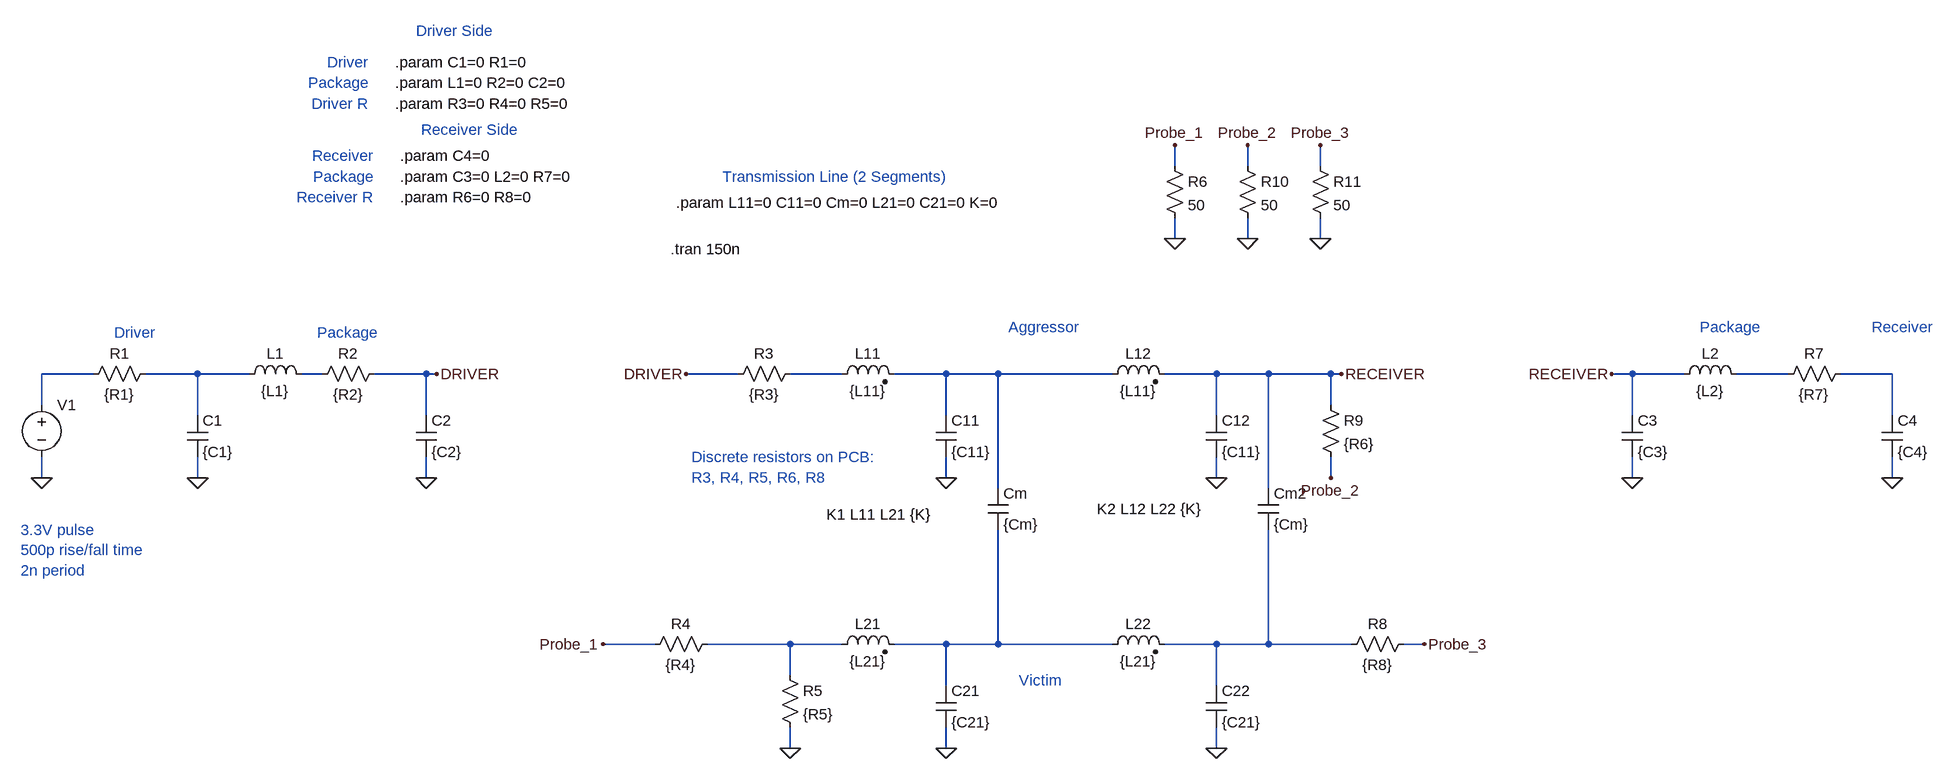
[diagram p0: schematic circuit_model.asc]
circuit_model.asc, the LTspice schematic file:
Version 4
SHEET 1 2504 696
WIRE 1328 -240 1328 -272
WIRE 1440 -240 1440 -272
WIRE 1552 -240 1552 -272
WIRE 1328 -128 1328 -160
WIRE 1440 -128 1440 -160
WIRE 1552 -128 1552 -160
WIRE -336 80 -416 80
WIRE -176 80 -256 80
WIRE -96 80 -176 80
WIRE 16 80 -16 80
WIRE 176 80 96 80
WIRE 192 80 176 80
WIRE 656 80 576 80
WIRE 816 80 736 80
WIRE 976 80 896 80
WIRE 1056 80 976 80
WIRE 1232 80 1056 80
WIRE 1392 80 1312 80
WIRE 1472 80 1392 80
WIRE 1568 80 1472 80
WIRE 1584 80 1568 80
WIRE 2032 80 2000 80
WIRE 2112 80 2032 80
WIRE 2272 80 2192 80
WIRE 2432 80 2352 80
WIRE -416 128 -416 80
WIRE 1568 128 1568 80
WIRE -176 144 -176 80
WIRE 176 144 176 80
WIRE 976 144 976 80
WIRE 1392 144 1392 80
WIRE 2032 144 2032 80
WIRE 2432 144 2432 80
WIRE -416 240 -416 208
WIRE -176 240 -176 208
WIRE 176 240 176 208
WIRE 976 240 976 208
WIRE 1392 240 1392 208
WIRE 1568 240 1568 208
WIRE 2032 240 2032 208
WIRE 2432 240 2432 208
WIRE 1056 256 1056 80
WIRE 1472 256 1472 80
WIRE 528 496 448 496
WIRE 736 496 608 496
WIRE 816 496 736 496
WIRE 976 496 896 496
WIRE 1056 496 1056 320
WIRE 1056 496 976 496
WIRE 1232 496 1056 496
WIRE 1392 496 1312 496
WIRE 1472 496 1472 320
WIRE 1472 496 1392 496
WIRE 1600 496 1472 496
WIRE 1712 496 1680 496
WIRE 736 544 736 496
WIRE 976 560 976 496
WIRE 1392 560 1392 496
WIRE 736 656 736 624
WIRE 976 656 976 624
WIRE 1392 656 1392 624
FLAG -416 240 0
FLAG -176 240 0
FLAG 176 240 0
FLAG 976 240 0
FLAG 976 656 0
FLAG 736 656 0
FLAG 1392 240 0
FLAG 1392 656 0
FLAG 2032 240 0
FLAG 2432 240 0
FLAG 192 80 DRIVER
FLAG 576 80 DRIVER
FLAG 1584 80 RECEIVER
FLAG 2000 80 RECEIVER
FLAG 448 496 Probe_1
FLAG 1712 496 Probe_3
FLAG 1568 240 Probe_2
FLAG 1552 -272 Probe_3
FLAG 1440 -272 Probe_2
FLAG 1328 -272 Probe_1
FLAG 1328 -128 0
FLAG 1440 -128 0
FLAG 1552 -128 0
SYMBOL voltage -416 112 R0
WINDOW 3 24 96 Invisible 2
WINDOW 123 0 0 Left 0
WINDOW 39 0 0 Left 0
SYMATTR Value PULSE(0 3.3 50n 500p 500p 25n 50n)
SYMATTR InstName V1
SYMBOL res -240 64 R90
WINDOW 0 0 56 VBottom 2
WINDOW 3 32 56 VTop 2
SYMATTR InstName R1
SYMATTR Value {R1}
SYMBOL cap -192 144 R0
SYMATTR InstName C1
SYMATTR Value {C1}
SYMBOL ind -112 96 R270
WINDOW 0 32 56 VTop 2
WINDOW 3 5 56 VBottom 2
SYMATTR InstName L1
SYMATTR Value {L1}
SYMBOL res 112 64 R90
WINDOW 0 0 56 VBottom 2
WINDOW 3 32 56 VTop 2
SYMATTR InstName R2
SYMATTR Value {R2}
SYMBOL cap 160 144 R0
SYMATTR InstName C2
SYMATTR Value {C2}
SYMBOL res 752 64 R90
WINDOW 0 0 56 VBottom 2
WINDOW 3 32 56 VTop 2
SYMATTR InstName R3
SYMATTR Value {R3}
SYMBOL ind2 800 96 R270
WINDOW 0 32 56 VTop 2
WINDOW 3 5 56 VBottom 2
SYMATTR InstName L11
SYMATTR Value {L11}
SYMATTR Type ind
SYMBOL cap 960 144 R0
SYMATTR InstName C11
SYMATTR Value {C11}
SYMBOL cap 1040 256 R0
SYMATTR InstName Cm
SYMATTR Value {Cm}
SYMBOL cap 960 560 R0
SYMATTR InstName C21
SYMATTR Value {C21}
SYMBOL ind2 800 512 R270
WINDOW 0 32 56 VTop 2
WINDOW 3 5 56 VBottom 2
SYMATTR InstName L21
SYMATTR Value {L21}
SYMATTR Type ind
SYMBOL res 720 528 R0
SYMATTR InstName R5
SYMATTR Value {R5}
SYMBOL res 624 480 R90
WINDOW 0 0 56 VBottom 2
WINDOW 3 32 56 VTop 2
SYMATTR InstName R4
SYMATTR Value {R4}
SYMBOL ind2 1216 96 R270
WINDOW 0 32 56 VTop 2
WINDOW 3 5 56 VBottom 2
SYMATTR InstName L12
SYMATTR Value {L11}
SYMATTR Type ind
SYMBOL cap 1376 144 R0
SYMATTR InstName C12
SYMATTR Value {C11}
SYMBOL cap 1456 256 R0
SYMATTR InstName Cm2
SYMATTR Value {Cm}
SYMBOL cap 1376 560 R0
SYMATTR InstName C22
SYMATTR Value {C21}
SYMBOL ind2 1216 512 R270
WINDOW 0 32 56 VTop 2
WINDOW 3 5 56 VBottom 2
SYMATTR InstName L22
SYMATTR Value {L21}
SYMATTR Type ind
SYMBOL res 1584 512 R270
WINDOW 0 32 56 VTop 2
WINDOW 3 0 56 VBottom 2
SYMATTR InstName R8
SYMATTR Value {R8}
SYMBOL cap 2016 144 R0
SYMATTR InstName C3
SYMATTR Value {C3}
SYMBOL res 2368 64 R90
WINDOW 0 0 56 VBottom 2
WINDOW 3 32 56 VTop 2
SYMATTR InstName R7
SYMATTR Value {R7}
SYMBOL ind 2096 96 R270
WINDOW 0 32 56 VTop 2
WINDOW 3 5 56 VBottom 2
SYMATTR InstName L2
SYMATTR Value {L2}
SYMBOL cap 2416 144 R0
SYMATTR InstName C4
SYMATTR Value {C4}
SYMBOL res 1552 112 R0
SYMATTR InstName R9
SYMATTR Value {R6}
SYMBOL res 1312 -256 R0
SYMATTR InstName R6
SYMATTR Value 50
SYMBOL res 1424 -256 R0
SYMATTR InstName R10
SYMATTR Value 50
SYMBOL res 1536 -256 R0
SYMATTR InstName R11
SYMATTR Value 50
TEXT -304 16 Left 2 ;Driver
TEXT 8 16 Left 2 ;Package
TEXT 1072 8 Left 2 ;Aggressor
TEXT 1088 552 Left 2 ;Victim
TEXT 2136 8 Left 2 ;Package
TEXT 2400 8 Left 2 ;Receiver
TEXT 792 296 Left 2 !K1 L11 L21 {K}
TEXT 1208 288 Left 2 !K2 L12 L22 {K}
TEXT 128 -400 Left 2 !.param C1=0 R1=0
TEXT 88 -400 Right 2 ;Driver
TEXT 88 -368 Right 2 ;Package
TEXT 128 -368 Left 2 !.param L1=0 R2=0 C2=0
TEXT 88 -336 Right 2 ;Driver R
TEXT 128 -336 Left 2 !.param R3=0 R4=0 R5=0
TEXT 136 -256 Left 2 !.param C4=0
TEXT 96 -256 Right 2 ;Receiver
TEXT 96 -224 Right 2 ;Package
TEXT 136 -224 Left 2 !.param C3=0 L2=0 R7=0
TEXT 96 -192 Right 2 ;Receiver R
TEXT 136 -192 Left 2 !.param R6=0 R8=0
TEXT 160 -448 Left 2 ;Driver Side
TEXT 168 -296 Left 2 ;Receiver Side
TEXT 560 -184 Left 2 !.param L11=0 C11=0 Cm=0 L21=0 C21=0 K=0
TEXT 632 -224 Left 2 ;Transmission Line (2 Segments)
TEXT 584 208 Left 2 ;Discrete resistors on PCB:\nR3, R4, R5, R6, R8
TEXT -448 320 Left 2 ;3.3V pulse\n500p rise/fall time\n2n period
TEXT 552 -112 Left 2 !.tran 150n

The netlist it stands for:
* circuit_model.asc
V1 N001 0 PULSE(0 3.3 50n 500p 500p 25n 50n)
R1 N002 N001 {R1}
C1 N002 0 {C1}
L1 N002 N003 {L1}
R2 DRIVER N003 {R2}
C2 DRIVER 0 {C2}
R3 N004 DRIVER {R3}
L11 N004 N005 {L11}
C11 N005 0 {C11}
Cm N005 N009 {Cm}
C21 N009 0 {C21}
L21 N008 N009 {L21}
R5 N008 0 {R5}
R4 N008 Probe_1 {R4}
L12 N005 RECEIVER {L11}
C12 RECEIVER 0 {C11}
Cm2 RECEIVER N010 {Cm}
C22 N010 0 {C21}
L22 N009 N010 {L21}
R8 N010 Probe_3 {R8}
C3 RECEIVER 0 {C3}
R7 N007 N006 {R7}
L2 RECEIVER N006 {L2}
C4 N007 0 {C4}
R9 RECEIVER Probe_2 {R6}
R6 Probe_1 0 50
R10 Probe_2 0 50
R11 Probe_3 0 50
* Driver
* Package
* Aggressor
* Victim
* Package
* Receiver
K1 L11 L21 {K}
K2 L12 L22 {K}
.param C1=0 R1=0
* Driver
* Package
.param L1=0 R2=0 C2=0
* Driver R
.param R3=0 R4=0 R5=0
.param C4=0
* Receiver
* Package
.param C3=0 L2=0 R7=0
* Receiver R
.param R6=0 R8=0
* Driver Side
* Receiver Side
.param L11=0 C11=0 Cm=0 L21=0 C21=0 K=0
* Transmission Line (2 Segments)
* Discrete resistors on PCB:
* R3, R4, R5, R6, R8
* 3.3V pulse
* 500p rise/fall time
* 2n period
.tran 150n
.backanno
.end